# EAGLE schematic ATMEGA328 (EAGLE 8.6.0)
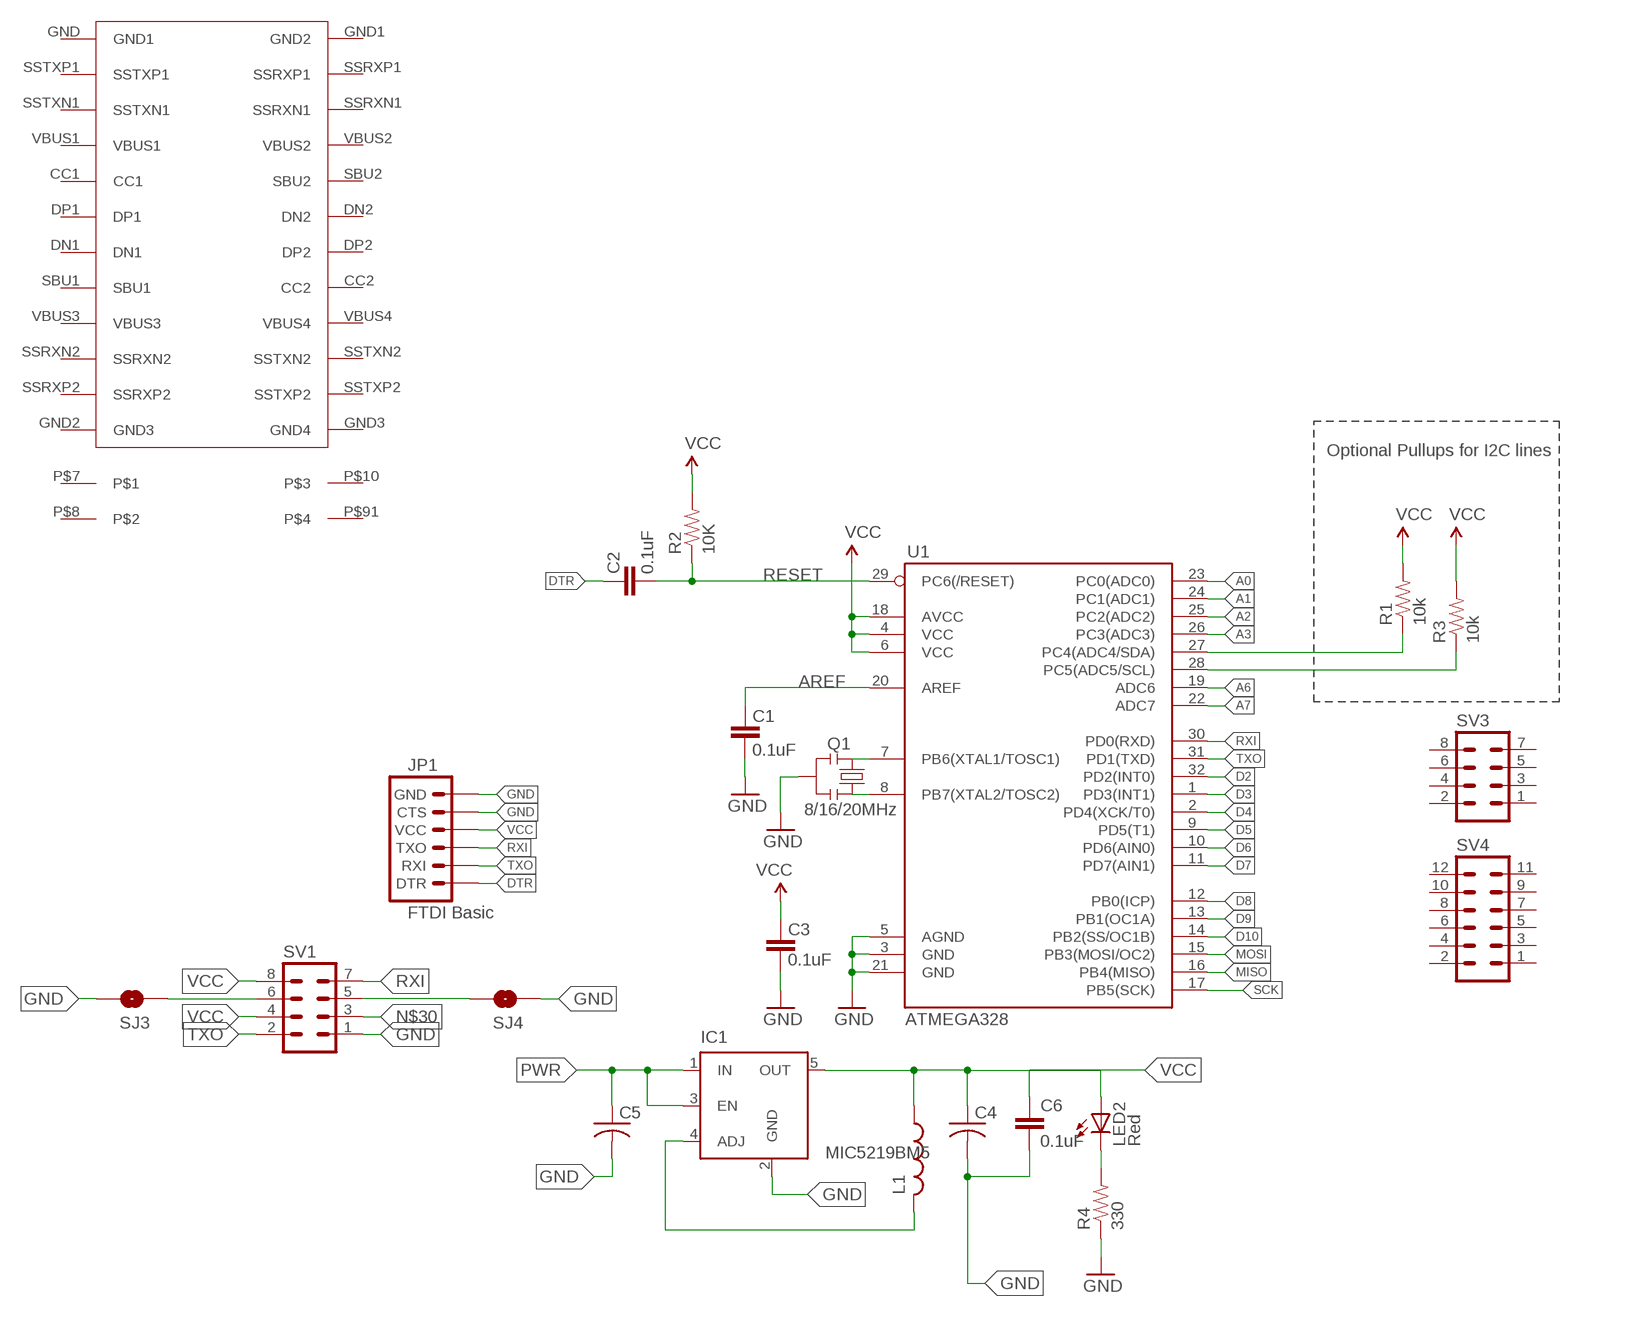
[diagram p0: schematic, sheet 1]

## Parts
C1  0.1uF  CAP0603-CAP  [0603-CAP]
C2  0.1uF  CAP0603-CAP  [0603-CAP]
C3  0.1uF  CAP0603-CAP  [0603-CAP]
C4  C-USC0805K  [C0805K]
C5  C-USC0805K  [C0805K]
C6  0.1uF  CAP0603-CAP  [0603-CAP]
IC1  MIC5219BM5  [SOT23-5]
JP1  FTDI Basic  ARDUINO_SERIAL_PROGRAMPTH  [1X06]
L1  L-USL2012C  [L2012C]
LED2  Red  LED  [0603-LED-ALT1]
Q1  8/16/20MHz  RESONATOR1:1  [RESONATOR-SMD-1:1]
R1  10k  RESISTOR0603-RES  [0603-RES]
R2  10K  RESISTOR0603-RES  [0603-RES]
R3  10k  RESISTOR0603-RES  [0603-RES]
R4  330  RESISTOR0603-RES  [0603-RES]
SJ3  SOLDERJUMPERNC  [SJ_2S]
SJ4  SOLDERJUMPERNC  [SJ_2S]
SV1  MA04-2  [MA04-2]
SV3  MA04-2  [MA04-2]
SV4  MA06-2  [MA06-2]
U1  ATMEGA328  ATMEGA168  [TQFP32-08]
U$1  USB-C  [USB-C]

## Nets
A0: U1.23(PC0(ADC0))
A1: U1.24(PC1(ADC1))
A2: U1.25(PC2(ADC2))
A3: U1.26(PC3(ADC3))
A4: R1.1 U1.27(PC4(ADC4/SDA))
A5: R3.1 U1.28(PC5(ADC5/SCL))
A6: U1.19(ADC6)
A7: U1.22(ADC7)
AREF: C1.2 U1.20(AREF)
D2: U1.32(PD2(INT0))
D3: U1.1(PD3(INT1))
D4: U1.2(PD4(XCK/T0))
D5: U1.9(PD5(T1))
D6: U1.10(PD6(AIN0))
D7: U1.11(PD7(AIN1))
D8: U1.12(PB0(ICP))
D9: U1.13(PB1(OC1A))
D10: U1.14(PB2(SS/OC1B))
DTR: C2.2 JP1.1(DTR)
GND [vcc]: C1.1 C3.1 C4.2 C5.2 C6.2 IC1.2(GND) JP1.5(CTS) JP1.6(GND) Q1.2 R4.1 SJ3.2 SJ4.1 SV1.1 U1.3(GND) U1.5(AGND) U1.21(GND)
MISO: U1.16(PB4(MISO))
MOSI: U1.15(PB3(MOSI/OC2))
N$1: Q1.3 U1.8(PB7(XTAL2/TOSC2))
N$2: Q1.1 U1.7(PB6(XTAL1/TOSC1))
N$5: LED2.C R4.2
N$29: SJ4.2 SV1.5
N$30: SV1.3
N$31: IC1.4(ADJ) L1.2
PWR: C5.1 IC1.1(IN) IC1.3(EN)
RESET: C2.1 R2.1 U1.29(PC6(/RESET))
RESET_WIFI: SJ3.1 SV1.6
RXI: JP1.3(TXO) SV1.7 U1.30(PD0(RXD))
SCK: U1.17(PB5(SCK))
TXO: JP1.2(RXI) SV1.2 U1.31(PD1(TXD))
VCC: C3.2 C4.1 C6.1 IC1.5(OUT) JP1.4(VCC) L1.1 LED2.A R1.2 R2.2 R3.2 SV1.4 SV1.8 U1.4(VCC) U1.6(VCC) U1.18(AVCC)
Unconnected: SV3.1 SV3.2 SV3.3 SV3.4 SV3.5 SV3.6 SV3.7 SV3.8 SV4.1 SV4.2 SV4.3 SV4.4 SV4.5 SV4.6 SV4.7 SV4.8 SV4.9 SV4.10 SV4.11 SV4.12 U$1.CC1 U$1.CC2 U$1.DN1 U$1.DN2 U$1.DP1 U$1.DP2 U$1.GND1(GND2) U$1.GND2(GND3) U$1.GND3(GND4) U$1.GND(GND1) U$1.P$7 U$1.P$8 U$1.P$10 U$1.P$91 U$1.SBU1 U$1.SBU2 U$1.SSRXN1 U$1.SSRXN2 U$1.SSRXP1 U$1.SSRXP2 U$1.SSTXN1 U$1.SSTXN2 U$1.SSTXP1 U$1.SSTXP2 U$1.VBUS1 U$1.VBUS2 U$1.VBUS3 U$1.VBUS4

## Notes on the sheet
- Optional Pullups for I2C lines

## Library data of the parts
C1-C3 C6 = SparkFun:CAP: Capacitor Standard 0603 ceramic capacitor, and 0.1" leaded capacitor.
C4 C5 = resistor:C-US: CAPACITOR, American symbol
IC1 = v-reg-micrel:MIC5219BM5: VOLTAGE REGULATOR; MF: ALTERA CORPORATION; MPN: MIC5219BM5 TR; OC_FARNELL: 1100656; OC_NEWARK: 09J8939
JP1 = SparkFun:ARDUINO_SERIAL_PROGRAM
L1 = rcl:L-US: INDUCTOR, American symbol; SPICEPREFIX: L
LED2 = Testing:LED: LEDs Standard schematic elements and footprints for 5mm, 3mm, 1206, and 0603 sized LEDs. 5mm - Spark Fun Electronics SKU : COM-00529 (and others)
Q1 = Testing:RESONATOR: Resonator Small SMD resonator. This is the itty bitty 10/20MHz resonators with built in caps. CSTCE10M0G55 and CSTCE20M0V53. Footprint for SMD has been used in SFE production for years, and does work okay. 1:1 is an attempt to get larger fillets on the sides so it will be easier to inspect these solders in our AOI machine. The pads have been minimized to match the actual metal under the resonator. To see this relation, it includes an image import of the bottom side of the component. Imported to scale on layer 200.
R1-R4 = SparkFun:RESISTOR: Resistor Basic schematic elements and footprints for 0603, 1206, and PTH resistors.
SJ3 SJ4 = SparkFun-Passives:SOLDERJUMPER: Solder Jumper Standard SMD solder jumper. Used to automate production. Two varients : Normally Open and Normally Closed are the same, but have different paste layers. NC will have a large amount of paste and should jumper during reflow.
SV1 SV3 = con-lstb:MA04-2: PIN HEADER; OC_FARNELL: unknown; OC_NEWARK: unknown
SV4 = con-lstb:MA06-2: PIN HEADER; OC_FARNELL: unknown; OC_NEWARK: unknown
U1 = SparkFun:ATMEGA168
U$1 = USB-C:USB-C

## Net classes
0 default: width 0.203 mm, drill 0.203 mm, clearance 0.203 mm
1 vcc: width 0.254 mm